# EAGLE schematic 526_AI_BLOCKS_Rev100 (EAGLE 9.6.2)
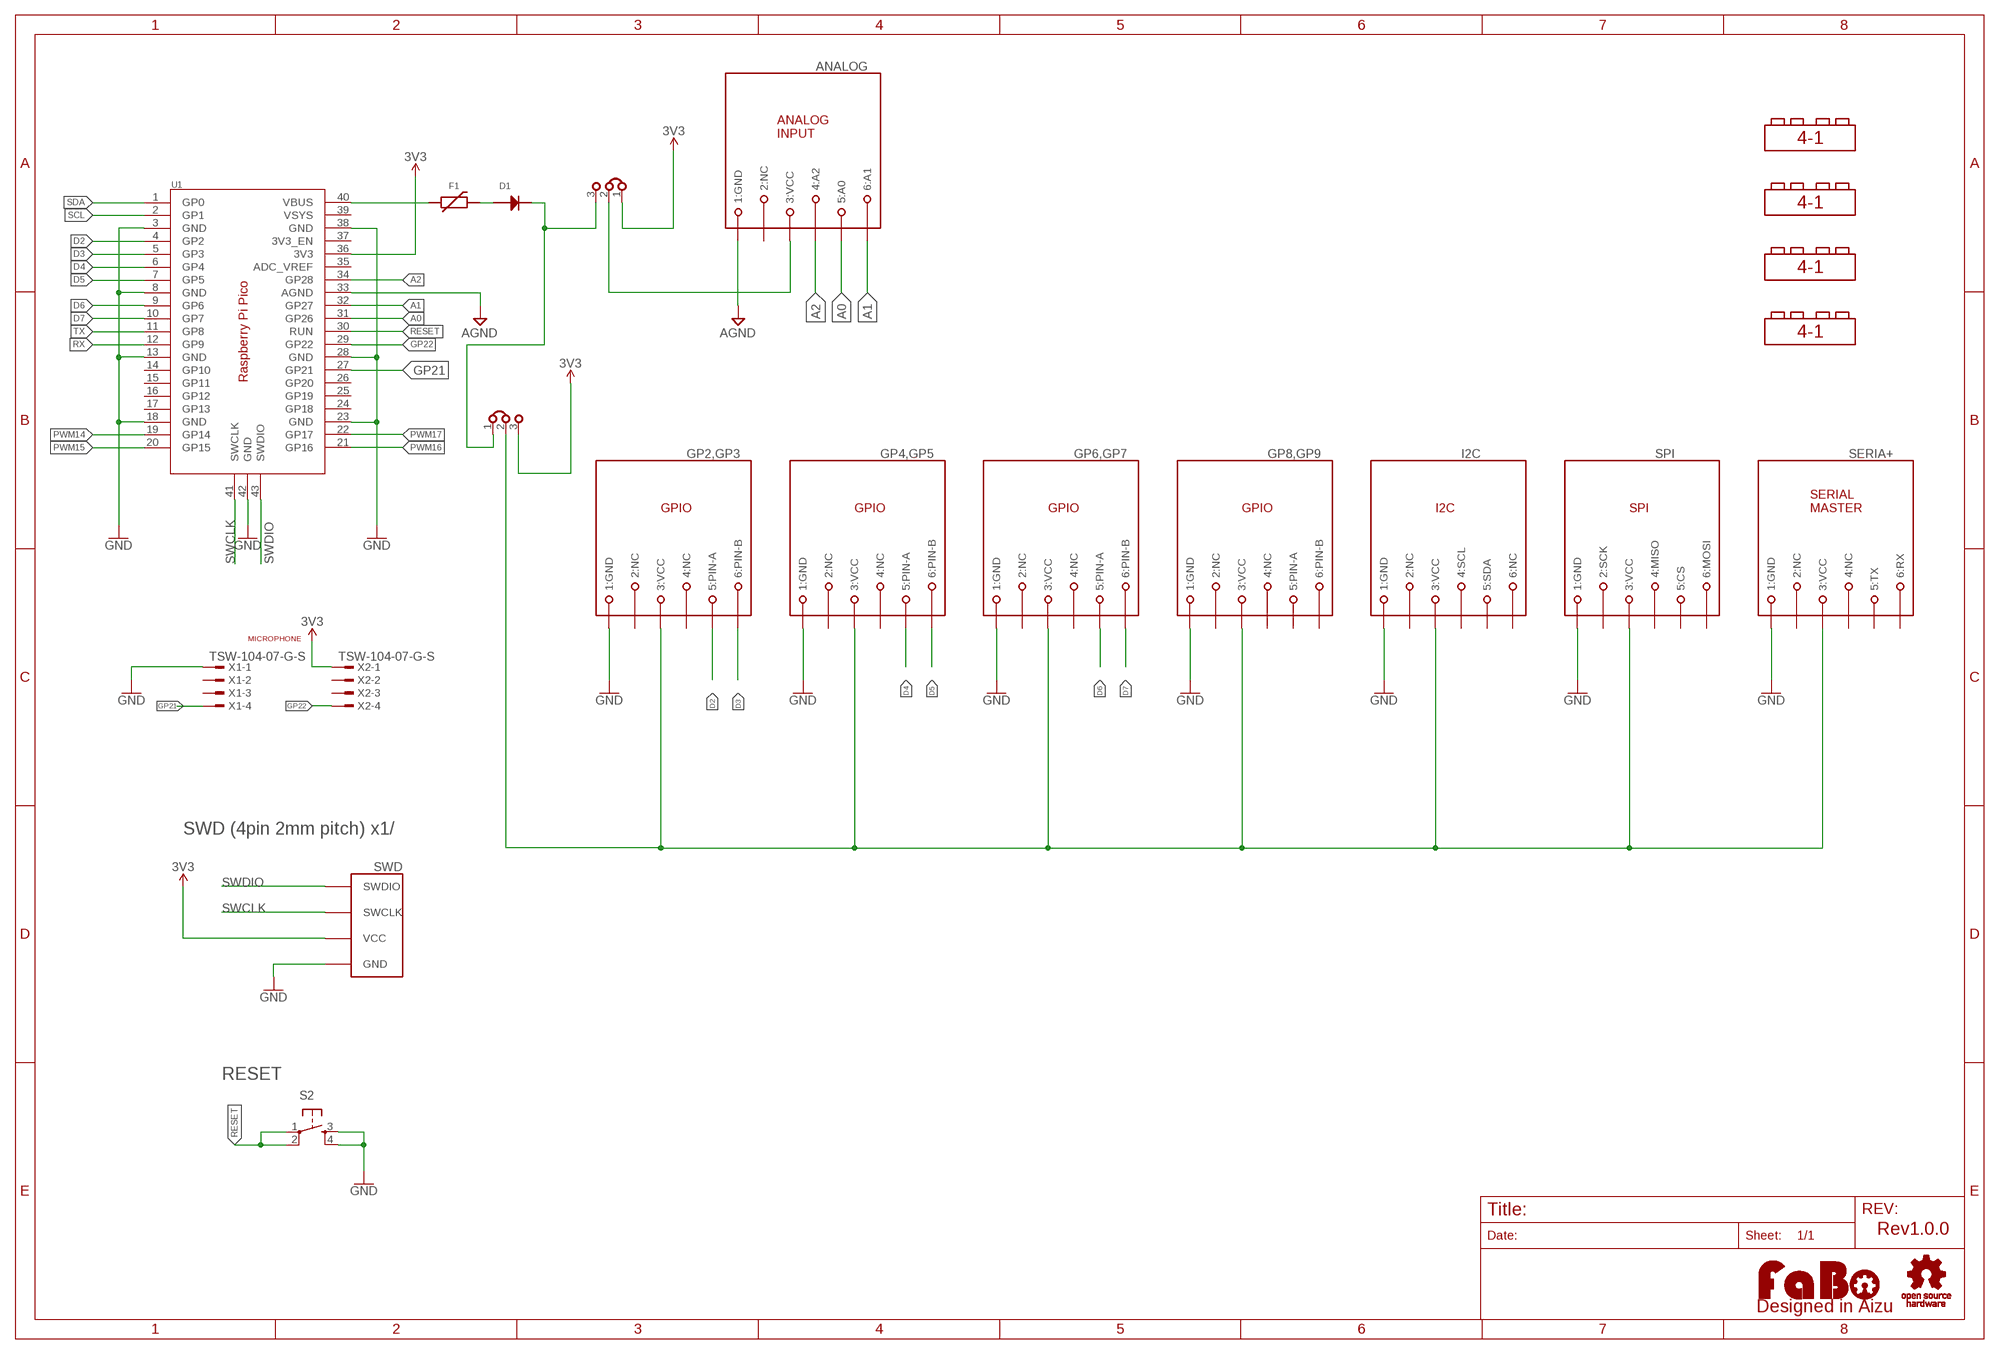
[diagram p0: schematic, sheet 1]

## Parts
ANALOG  MODULAR-JACK-6P-RJ11_ANALOG3  [7002-6PXC-X]
D1  NRVS1MFL  [SD-123F]
F1  POLYSWITCH  [0603]
GP2,GP3  MODULAR-JACK-6P-RJ11_GPIO  [7002-6PXC-X]
GP4,GP5  MODULAR-JACK-6P-RJ11_GPIO  [7002-6PXC-X]
GP6,GP7  MODULAR-JACK-6P-RJ11_GPIO  [7002-6PXC-X]
GP8,GP9  MODULAR-JACK-6P-RJ11_GPIO  [7002-6PXC-X]
I2C  MODULAR-JACK-6P-RJ11_I2C  [7002-6PXC-X]
JP4  JUMPERS_JP2-2MM  [JUMPERS_JP2-2MM]
JP7  JUMPERS_JP2-2MM  [JUMPERS_JP2-2MM]
LOGO1  LOGO_OSHW-M_BOTTOM  [LOGO_OSHW_M_BOTTOM]
LOGO2  LOGO_FABO-M  [LOGO_FABO_M]
S2  TACT-SWITCH-SMD_KMR2  [KMR2]
SERIA+  MODULAR-JACK-6P-RJ11_SERIAL_M  [7002-6PXC-X]
SPI  MODULAR-JACK-6P-RJ11_SPI  [7002-6PXC-X]
SWD  FABO-SWD-4PIN  [FABO_BRICK_SWD_B04B-PASK-1_SILK]
U1  RASPBERRY_PI_PICORASPBERRY_PI_PICO_2BY20TH  [RASPBERRY_PI_PICO_HEADER_BOTH]
U$4  BLOCK_4-1  [4-1BLOCK]
U$5  BLOCK_4-1  [4-1BLOCK]
U$6  BLOCK_4-1  [4-1BLOCK]
U$7  BLOCK_4-1  [4-1BLOCK]
X1  TSW-104-07-G-S  [TSW-104-XX-G-S]
X2  TSW-104-07-G-S  [TSW-104-XX-G-S]

## Nets
3V3: JP4.3 JP7.1 SWD.VCC U1.36(3V3) X2.1
A0: ANALOG.5(5:A0) U1.31(GP26)
A1: ANALOG.6(6:A1) U1.32(GP27)
A2: ANALOG.4(4:A2) U1.34(GP28)
AGND: ANALOG.1(1:GND) U1.33(AGND)
D2: GP2,GP3.5(5:PIN-A) U1.4(GP2)
D3: GP2,GP3.6(6:PIN-B) U1.5(GP3)
D4: GP4,GP5.5(5:PIN-A) U1.6(GP4)
D5: GP4,GP5.6(6:PIN-B) U1.7(GP5)
D6: GP6,GP7.5(5:PIN-A) U1.9(GP6)
D7: GP6,GP7.6(6:PIN-B) U1.10(GP7)
GND: GP2,GP3.1(1:GND) GP4,GP5.1(1:GND) GP6,GP7.1(1:GND) GP8,GP9.1(1:GND) I2C.1(1:GND) S2.3 S2.4 SERIA+.1(1:GND) SPI.1(1:GND) SWD.GND U1.3(GND) U1.8(GND) U1.13(GND) U1.18(GND) U1.23(GND) U1.28(GND) U1.38(GND) U1.42(GND) X1.1
GP21: U1.27(GP21) X1.4
GP22: U1.29(GP22) X2.4
N$1: D1.2(CATHODE) JP4.1 JP7.3
N$2: ANALOG.3(3:VCC) JP7.2
N$4: F1.1 U1.40(VBUS)
N$5: D1.1(ANODE) F1.2
N$7: GP2,GP3.3(3:VCC) GP4,GP5.3(3:VCC) GP6,GP7.3(3:VCC) GP8,GP9.3(3:VCC) I2C.3(3:VCC) JP4.2 SERIA+.3(3:VCC) SPI.3(3:VCC)
PWM14: U1.19(GP14)
PWM15: U1.20(GP15)
PWM16: U1.21(GP16)
PWM17: U1.22(GP17)
RESET: S2.1 S2.2 U1.30(RUN)
RX: U1.12(GP9)
SCL: U1.2(GP1)
SDA: U1.1(GP0)
SWCLK: SWD.SWCLK U1.41(SWCLK)
SWDIO: SWD.SWDIO U1.43(SWDIO)
TX: U1.11(GP8)
Unconnected: ANALOG.2(2:NC) GP2,GP3.2(2:NC) GP2,GP3.4(4:NC) GP4,GP5.2(2:NC) GP4,GP5.4(4:NC) GP6,GP7.2(2:NC) GP6,GP7.4(4:NC) GP8,GP9.2(2:NC) GP8,GP9.4(4:NC) GP8,GP9.5(5:PIN-A) GP8,GP9.6(6:PIN-B) I2C.2(2:NC) I2C.4(4:SCL) I2C.5(5:SDA) I2C.6(6:NC) SERIA+.2(2:NC) SERIA+.4(4:NC) SERIA+.5(5:TX) SERIA+.6(6:RX) SPI.2(2:SCK) SPI.4(4:MISO) SPI.5(5:CS) SPI.6(6:MOSI) U1.14(GP10) U1.15(GP11) U1.16(GP12) U1.17(GP13) U1.24(GP18) U1.25(GP19) U1.26(GP20) U1.35(ADC_VREF) U1.37(3V3_EN) U1.39(VSYS) X1.2 X1.3 X2.2 X2.3

## Notes on the sheet
- MICROPHONE
- SWD (4pin 2mm pitch) x1/
- RESET
- Rev1.0.0

## Library data of the parts
ANALOG = FaBo-Connetor:MODULAR-JACK-6P-RJ11_ANALOG3
D1 = FaBo-Diode:NRVS1MFL
F1 = FaBo-Thermistors:POLYSWITCH
GP2,GP3 GP4,GP5 GP6,GP7 GP8,GP9 = FaBo-Connetor:MODULAR-JACK-6P-RJ11_GPIO
I2C = FaBo-Connetor:MODULAR-JACK-6P-RJ11_I2C
JP4 JP7 = 52101-101-REV-A_v16:JUMPERS_JP2-: Jumper/Bridge
LOGO1 = FaBo-Logo:LOGO_OSHW
LOGO2 = FaBo-Logo:LOGO_FABO
S2 = FaBo-Switch:TACT-SWITCH: Part No Maker Datasheet Distributor 1273HA-160G-G SWITRONIC Catalog <http://www.switronic.com/uploads/images/A10.gif> Akizuki <http://akizukidenshi.com/catalog/g/gP-02561/> DTS-6-V Cosland DTS 6 Series <http://www.cosland.com/newproduct/DTS%20SERIES.pdf> Akizuki <http://akizukidenshi.com/catalog/g/gP-03647/> KMR2 C&K KMR2 SERIES <https://www.ckswitches.com/products/switches/product-details/Tactile/KMR2/> Octoparts Result <https://octopart.com/search?q=KMR2&start=0> TSHA-T-XB2-19E TOP UP INDUSTORY TSHA-T <http://www.top-up.com.tw/front/bin/ptdetail.phtml?Part=TSHA-T> Akizuki <http://akizukidenshi.com/catalog/g/gP-09361/>
SERIA+ = FaBo-Connetor:MODULAR-JACK-6P-RJ11_SERIAL_M
SPI = FaBo-Connetor:MODULAR-JACK-6P-RJ11_SPI
SWD = FaBo-Connetor:FABO-SWD-4PIN
U1 = FaBo-Boards:RASPBERRY_PI_PICO
U$4-U$7 = FaBo-Block:BLOCK_4-1
X1 X2 = con-samtec:TSW-104-*-G-S: THROUGH-HOLE .025" SQ POST HEADER Source: Samtec TSW.pdf; MF: Samtec Inc.; MPN: TSW-104-07-G-S